# EAGLE schematic oven-controller-v1 (EAGLE 6.4)
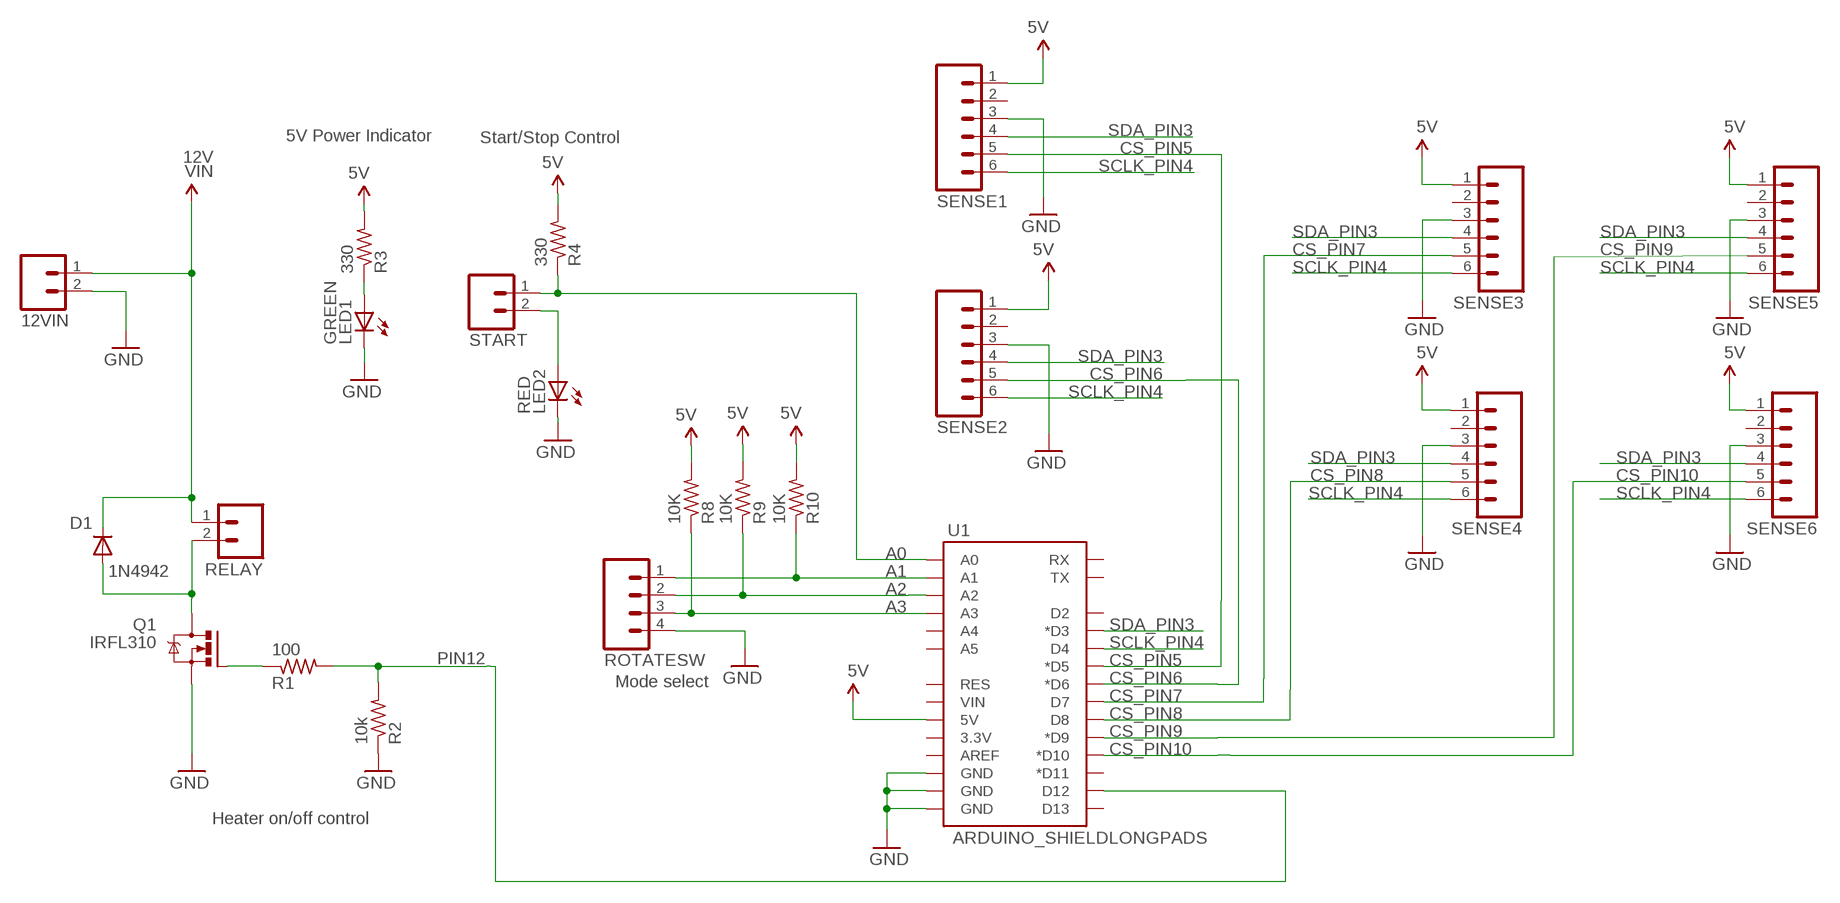
[diagram p0: schematic, sheet 1]

## Parts
12VIN  M023.5MM_LOCK  [SCREWTERMINAL-3.5MM-2_LOCK]
D1  1N4942  [DO41-10]
LED1  GREEN  LED5MM  [LED5MM]
LED2  RED  LED5MM  [LED5MM]
Q1  IRFL310  IRF520  [TO220BV]
R1  100  R-US_V234/12  [V234/12]
R2  10k  R-US_V234/12  [V234/12]
R3  330  R-US_0207/10  [0207/10]
R4  330  R-US_0207/10  [0207/10]
R8  10K  R-US_0207/10  [0207/10]
R9  10K  R-US_0207/10  [0207/10]
R10  10K  R-US_0207/10  [0207/10]
RELAY  M023.5MM_LOCK  [SCREWTERMINAL-3.5MM-2_LOCK]
ROTATESW  M04LOCK_LONGPADS  [1X04_LOCK_LONGPADS]
SENSE1  M06LOCK_LONGPADS  [1X06_LOCK_LONGPADS]
SENSE2  M06LOCK_LONGPADS  [1X06_LOCK_LONGPADS]
SENSE3  M06LOCK_LONGPADS  [1X06_LOCK_LONGPADS]
SENSE4  M06LOCK_LONGPADS  [1X06_LOCK_LONGPADS]
SENSE5  M06LOCK_LONGPADS  [1X06_LOCK_LONGPADS]
SENSE6  M06LOCK_LONGPADS  [1X06_LOCK_LONGPADS]
START  M023.5MM_LOCK  [SCREWTERMINAL-3.5MM-2_LOCK]
U1  ARDUINO_SHIELDLONGPADS  [DUEMILANOVE_SHIELD_LONGPADS]

## Nets
5V: R3.2 R4.2 R8.2 R9.2 R10.2 SENSE1.1 SENSE2.1 SENSE3.1 SENSE4.1 SENSE5.1 SENSE6.1 U1.5V
A0: R4.1 START.1 U1.A0
A1: R10.1 ROTATESW.1 U1.A1
A2: R9.1 ROTATESW.2 U1.A2
A3: R8.1 ROTATESW.3 U1.A3
CS_PIN5: SENSE1.5 U1.D5(*D5)
CS_PIN6: SENSE2.5 U1.D6(*D6)
CS_PIN7: SENSE3.5 U1.D7
CS_PIN8: SENSE4.5 U1.D8
CS_PIN9: SENSE5.5 U1.D9(*D9)
CS_PIN10: SENSE6.5 U1.D10(*D10)
GND: 12VIN.2 LED1.K(C) LED2.K(C) Q1.S R2.1 ROTATESW.4 SENSE1.3 SENSE2.3 SENSE3.3 SENSE4.3 SENSE5.3 SENSE6.3 U1.GND@0(GND) U1.GND@1(GND) U1.GND@2(GND)
N$2: Q1.G R1.1
N$3: D1.A Q1.D RELAY.2
N$10: LED2.A START.2
N$11: LED1.A R3.1
PIN12: R1.2 R2.2 U1.D12
SCLK_PIN4: SENSE1.6 SENSE2.6 SENSE3.6 SENSE4.6 SENSE5.6 SENSE6.6 U1.D4
SDA_PIN3: SENSE1.4 SENSE2.4 SENSE3.4 SENSE4.4 SENSE5.4 SENSE6.4 U1.D3(*D3)
VIN: 12VIN.1 D1.C RELAY.1
Unconnected: SENSE1.2 SENSE2.2 SENSE3.2 SENSE4.2 SENSE5.2 SENSE6.2 U1.3.3V U1.A4 U1.A5 U1.AREF U1.D2 U1.D11(*D11) U1.D13 U1.RES U1.RX U1.TX U1.VIN

## Notes on the sheet
- 5V Power Indicator | Start/Stop Control
- 12V
- Mode select
- Heater on/off control

## Library data of the parts
12VIN RELAY START = SparkFun-Connectors:M02: Header 2 Standard 2-pin 0.1" header. Use with straight break away headers (SKU : PRT-00116), right angle break away headers (PRT-00553), swiss pins (PRT-00743), machine pins (PRT-00117), and female headers (PRT-00115). Molex polarized connector foot print use with SKU : PRT-08233 with associated crimp pins and housings.
D1 = diode:1N4942: DIODE 1.0 A, 200 V, 150 ns
LED1 LED2 = led:LED: LED OSRAM: - CHIPLED LG R971, LG N971, LY N971, LG Q971, LY Q971, LO R971, LY R971 LH N974, LH R974 LS Q976, LO Q976, LY Q976 LO Q996 - Hyper CHIPLED LW Q18S LB Q993, LB Q99A, LB R99A - SideLED LS A670, LO A670, LY A670, LG A670, LP A670 LB A673, LV A673, LT A673, LW A673 LH A674 LY A675 LS A676, LA A676, LO A676, LY A676, LW A676 LS A679, LY A679, LG A679 - Hyper Micro SIDELED® LS Y876, LA Y876, LO Y876, LY Y876 LT Y87S - SmartLED LW L88C, LW L88S LB L89C, LB L89S, LG L890 LS L89K, LO L89K, LY L89K LS L896, LA L896, LO L896, LY L896 - TOPLED LS T670, LO T670, LY T670, LG T670, LP T670 LSG T670, LSP T670, LSY T670, LOP T670, LYG T670 LG T671, LOG T671, LSG T671 LB T673, LV T673, LT T673, LW T673 LH T674 LS T676, LA T676, LO T676, LY T676, LB T676, LH T676, LSB T676, LW T676 LB T67C, LV T67C, LT T67C, LS T67K, LO T67K, LY T67K, LW E67C LS E67B, LA E67B, LO E67B, LY E67B, LB E67C, LV E67C, LT E67C LW T67C LS T679, LY T679, LG T679 LS T770, LO T770, LY T770, LG T770, LP T770 LB T773, LV T773, LT T773, LW T773 LH T774 LS E675, LA E675, LY E675, LS T675 LS T776, LA T776, LO T776, LY T776, LB T776 LHGB T686 LT T68C, LB T68C - Hyper Mini TOPLED® LB M676 - Mini TOPLED Santana® LG M470 LS M47K, LO M47K, LY M47K Source: http://www.osram.convergy.de LUXEON: - LUMILED® LXK2-PW12-R00, LXK2-PW12-S00, LXK2-PW14-U00, LXK2-PW14-V00 LXK2-PM12-R00, LXK2-PM12-S00, LXK2-PM14-U00 LXK2-PE12-Q00, LXK2-PE12-R00, LXK2-PE12-S00, LXK2-PE14-T00, LXK2-PE14-U00 LXK2-PB12-K00, LXK2-PB12-L00, LXK2-PB12-M00, LXK2-PB14-N00, LXK2-PB14-P00, LXK2-PB14-Q00 LXK2-PR12-L00, LXK2-PR12-M00, LXK2-PR14-Q00, LXK2-PR14-R00 LXK2-PD12-Q00, LXK2-PD12-R00, LXK2-PD12-S00 LXK2-PH12-R00, LXK2-PH12-S00 LXK2-PL12-P00, LXK2-PL12-Q00, LXK2-PL12-R00 Source: www.luxeon.com KINGBRIGHT: KA-3528ASYC Source: www.kingbright.com
Q1 = transistor-power:IRF520: HEXFET Power MOSFET
R1-R4 R8-R10 = resistor:R-US_: RESISTOR, American symbol
ROTATESW = SparkFun-Connectors:M04: Header 4 Standard 4-pin 0.1" header. Use with straight break away headers (SKU : PRT-00116), right angle break away headers (PRT-00553), swiss pins (PRT-00743), machine pins (PRT-00117), and female headers (PRT-00115). Molex polarized connector foot print use with SKU : PRT-08231 with associated crimp pins and housings. 1MM SMD Version SKU: PRT-10208
SENSE1-SENSE6 = SparkFun-Connectors:M06: Header 6 Standard 6-pin 0.1" header. Use with straight break away headers (SKU : PRT-00116), right angle break away headers (PRT-00553), swiss pins (PRT-00743), machine pins (PRT-00117), and female headers (PRT-00115). Molex polarized connector foot print use with SKU : PRT-08094 with associated crimp pins and housings. NOTES ON THE VARIANTS LOCK and LOCK_LONGPADS... This footprint was designed to help hold the alignment of a through-hole component (i.e. 6-pin header) while soldering it into place. You may notice that each hole has been shifted either up or down by 0.005 of an inch from it's more standard position (which is a perfectly straight line). This slight alteration caused the pins (the squares in the middle) to touch the edges of the holes. Because they are alternating, it causes a "brace" to hold the component in place. 0.005 has proven to be the perfect amount of "off-center" position when using our standard breakaway headers. Although looks a little odd when you look at the bare footprint, once you have a header in there, the alteration is very hard to notice. Also, if you push a header all the way into place, it is covered up entirely on the bottom side. This idea of altering the position of holes to aid alignment will be further integrated into the Sparkfun Library for other footprints. It can help hold any component with 3 or more connection pins.
U1 = SparkFun-Boards:ARDUINO_SHIELD: Arduino shield footprint